# EAGLE schematic scenes main (EAGLE 7.4.0)
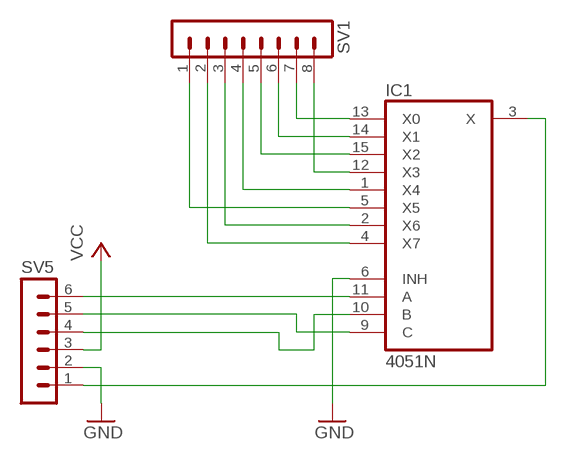
[diagram p0: schematic, sheet 1]

## Parts
IC1  4051N  [DIL16]
SV1  MA08-1  [MA08-1]
SV5  MA06-1  [MA06-1]

## Nets
GND: IC1.6(INH) SV5.2
N$1: IC1.1(X4) SV1.4
N$2: IC1.2(X6) SV1.3
N$3: IC1.4(X7) SV1.2
N$4: IC1.5(X5) SV1.1
N$5: IC1.15(X2) SV1.5
N$6: IC1.14(X1) SV1.6
N$7: IC1.13(X0) SV1.7
N$8: IC1.12(X3) SV1.8
N$9: IC1.9(C) SV5.5
N$10: IC1.10(B) SV5.4
N$11: IC1.11(A) SV5.6
N$75: IC1.3(X) SV5.1
VCC: SV5.3

## Power pins joined to a net without a drawn wire
GND: IC1.8(GND)
VCC: IC1.16(VCC)
VEE: IC1.7(VEE)

## Library data of the parts
IC1 = 40xx:4051: 8-channel ANALOG MULTIPLEXER
SV1 = con-lstb:MA08-1: PIN HEADER; OC_FARNELL: unknown; OC_NEWARK: unknown
SV5 = con-lstb:MA06-1: PIN HEADER; OC_FARNELL: unknown; OC_NEWARK: unknown